# EAGLE design Organ Power Supply v0.3 (EAGLE 8.4.0)
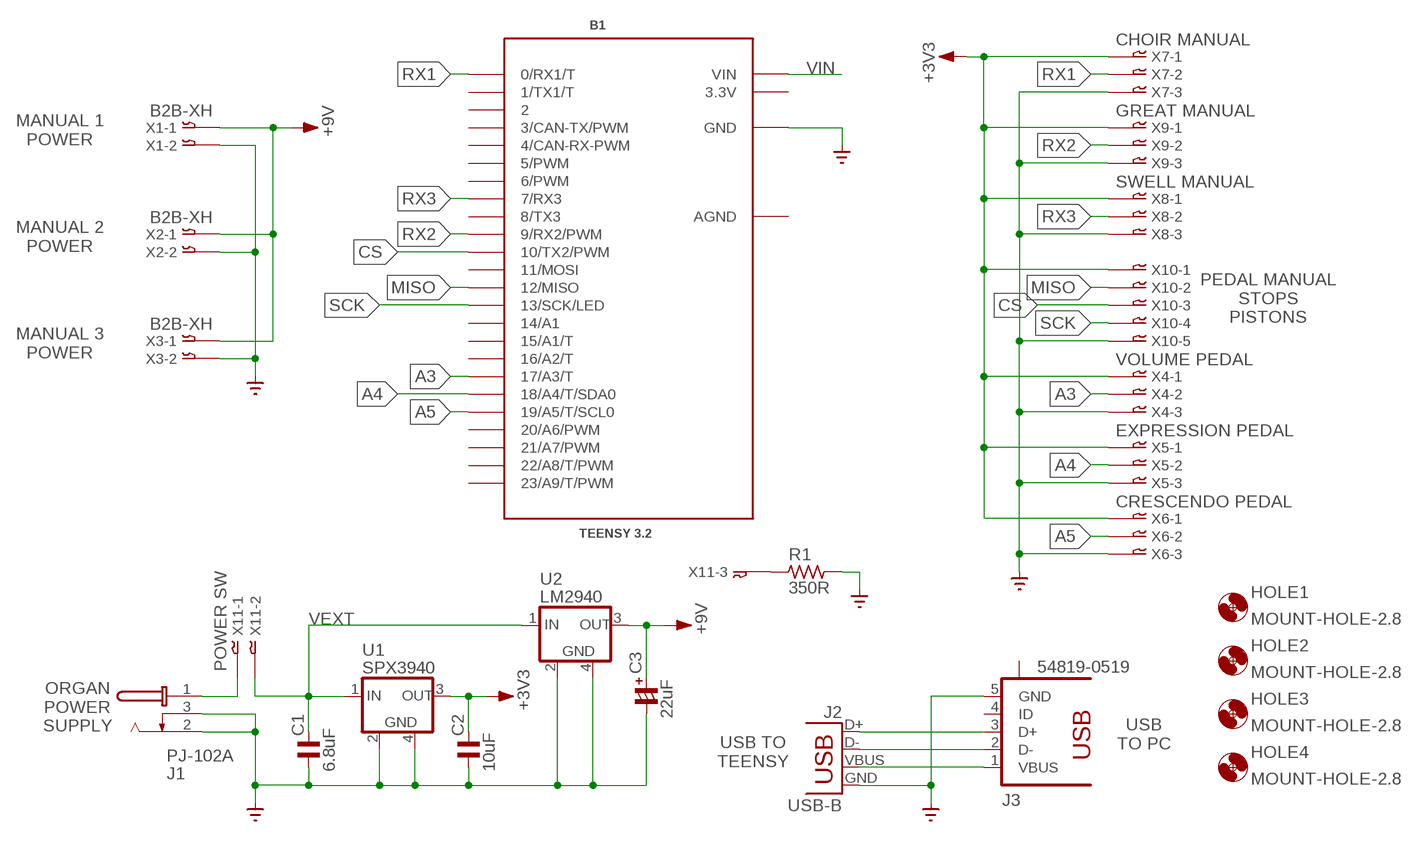
[diagram p0: schematic, sheet 1]

## Parts
B1  TEENSY 3.2  TEENSY_3.1_DIL  [TEENSY3-DIL]
C1  6.8uF  C_1206MP  [C1206MP]
C2  10uF  C_0805MP  [C0805MP]
C3  22uF  CP_3216-18R  [C3216-18R/T]
HOLE1  MOUNT-HOLE-2.8  [2,8]
HOLE2  MOUNT-HOLE-2.8  [2,8]
HOLE3  MOUNT-HOLE-2.8  [2,8]
HOLE4  MOUNT-HOLE-2.8  [2,8]
J1  PJ-102A  [PJ-102XH]
J2  USB-B  USBPTH  [USB-B-PTH]
J3  54819-0519  [54819-0519]
R1  350R  R_0805MP  [R0805MP]
U1  SPX3940  LM340NS  [SOT223]
U2  LM2940  LM340NS  [SOT223]
X1  B2B-XH  [B2B-XH-A]
X2  B2B-XH  [B2B-XH-A]
X3  B2B-XH  [B2B-XH-A]
X4  VOLUME PEDAL  03-JST-B3B-XH-A  [B3B-XH]
X5  EXPRESSION PEDAL  03-JST-B3B-XH-A  [B3B-XH]
X6  CRESCENDO PEDAL  03-JST-B3B-XH-A  [B3B-XH]
X7  CHOIR MANUAL  03-JST-B3B-XH-A  [B3B-XH]
X8  SWELL MANUAL  03-JST-B3B-XH-A  [B3B-XH]
X9  GREAT MANUAL  03-JST-B3B-XH-A  [B3B-XH]
X10  05-JST-B5B-XH-A  [B5B-XH]
X11  POWER SW  03-JST-B3B-XH-A  [B3B-XH]

## Nets
+3V3: C2.2 U1.3(OUT) X4.P$1 X5.P$1 X6.P$1 X7.P$1 X8.P$1 X9.P$1 X10.P$1
+9V: C3.+ U2.3(OUT) X1.P$1 X2.P$1 X3.P$1
A3: B1.17/A3(17/A3/T) X4.P$2
A4: B1.18/A4(18/A4/T/SDA0) X5.P$2
A5: B1.19/A5(19/A5/T/SCL0) X6.P$2
CS: B1.10(10/TX2/PWM) X10.P$3
GND: B1.GND C1.1 C2.1 C3.- J1.2(S) J1.3(SS) J2.GND J3.5(GND) R1.2 U1.2(GND) U1.4(GND) U2.2(GND) U2.4(GND) X1.P$2 X2.P$2 X3.P$2 X4.P$3 X5.P$3 X6.P$3 X7.P$3 X8.P$3 X9.P$3 X10.P$5
MISO: B1.12(12/MISO) X10.P$2
N$1: J2.VBUS J3.1(VBUS)
N$2: J1.1(T) X11.P$1
N$3: R1.1 X11.P$3
N$8: J2.D+ J3.3(D+)
N$9: J2.D- J3.2(D-)
RX1: B1.0(0/RX1/T) X7.P$2
RX2: B1.9(9/RX2/PWM) X9.P$2
RX3: B1.7(7/RX3) X8.P$2
SCK: B1.13(13/SCK/LED) X10.P$4
VEXT: C1.2 U1.1(IN) U2.1(IN) X11.P$2
VIN: B1.VIN
Unconnected: B1.1(1/TX1/T) B1.2 B1.3(3/CAN-TX/PWM) B1.4(4/CAN-RX-PWM) B1.5(5/PWM) B1.6(6/PWM) B1.8(8/TX3) B1.11(11/MOSI) B1.14/A0(14/A1) B1.15/A1(15/A1/T) B1.16/A2(16/A2/T) B1.20/A6(20/A6/PWM) B1.21/A7(21/A7/PWM) B1.22/A8(22/A8/T/PWM) B1.23/A9(23/A9/T/PWM) J3.4(ID) J3.S1 J3.S2

## Notes on the sheet
- MANUAL 1
  POWER
- MANUAL 2
  POWER
- PEDAL MANUAL
  STOPS
  PISTONS
- MANUAL 3
  POWER
- ORGAN
  POWER
  SUPPLY
- USB
  TO PC
- USB TO
  TEENSY

## Power pins joined to a net without a drawn wire
3.3V: B1.3.3V
AGND: B1.AGND

## Library data of the parts
B1 = Teensy_3_and_LC_Series_Boards_v1.1:TEENSY_3.1_DIL: Teensy 3.1 or 3.2 in a DIL Layout.
C1 C2 = rc-master-smd:C_: NON-POLARIZED CAP
C3 = rc-master:CP_: POLARIZED CAP
HOLE1-HOLE4 = holes:MOUNT-HOLE-: MOUNTING HOLE with drill center marker; BOM: EXCLUDE
J1 = jdc:PJ-102A: DC Power Jack PJ-102A (2.0 x 5.5 MM)
J2 = SparkFun-Connectors:USB: USB Connectors USB-B-PTH is fully proven SKU : PRT-00139/CONN-08278 USB-miniB is fully proven SKU : PRT-00587 USB-A-PCB is untested. USB-A-H is throughly reviewed, but untested. Spark Fun Electronics SKU : PRT-00437 USB-B-SMT is throughly reviewed, but untested. Needs silkscreen touching up. USB-A-S has not been used/tested USB-MB-H has not been used/tested USB-MICROB has been used. CONN-09505; PROD_ID: CONN-08278
J3 = con-usb:54819-0519: USB - OTG, miniUSB Type B, Molex
R1 = rc-master-smd:R_: RESISTOR
U1 U2 = v-reg:LM340: VOLTAGE REGULATOR
X1-X3 = jdc:B2B-XH: JST CONNECTOR
X4-X9 X11 = con-jst-xh:03-JST: JST CONNECTOR
X10 = con-jst-xh:05-JST: JST CONNECTOR

## Board
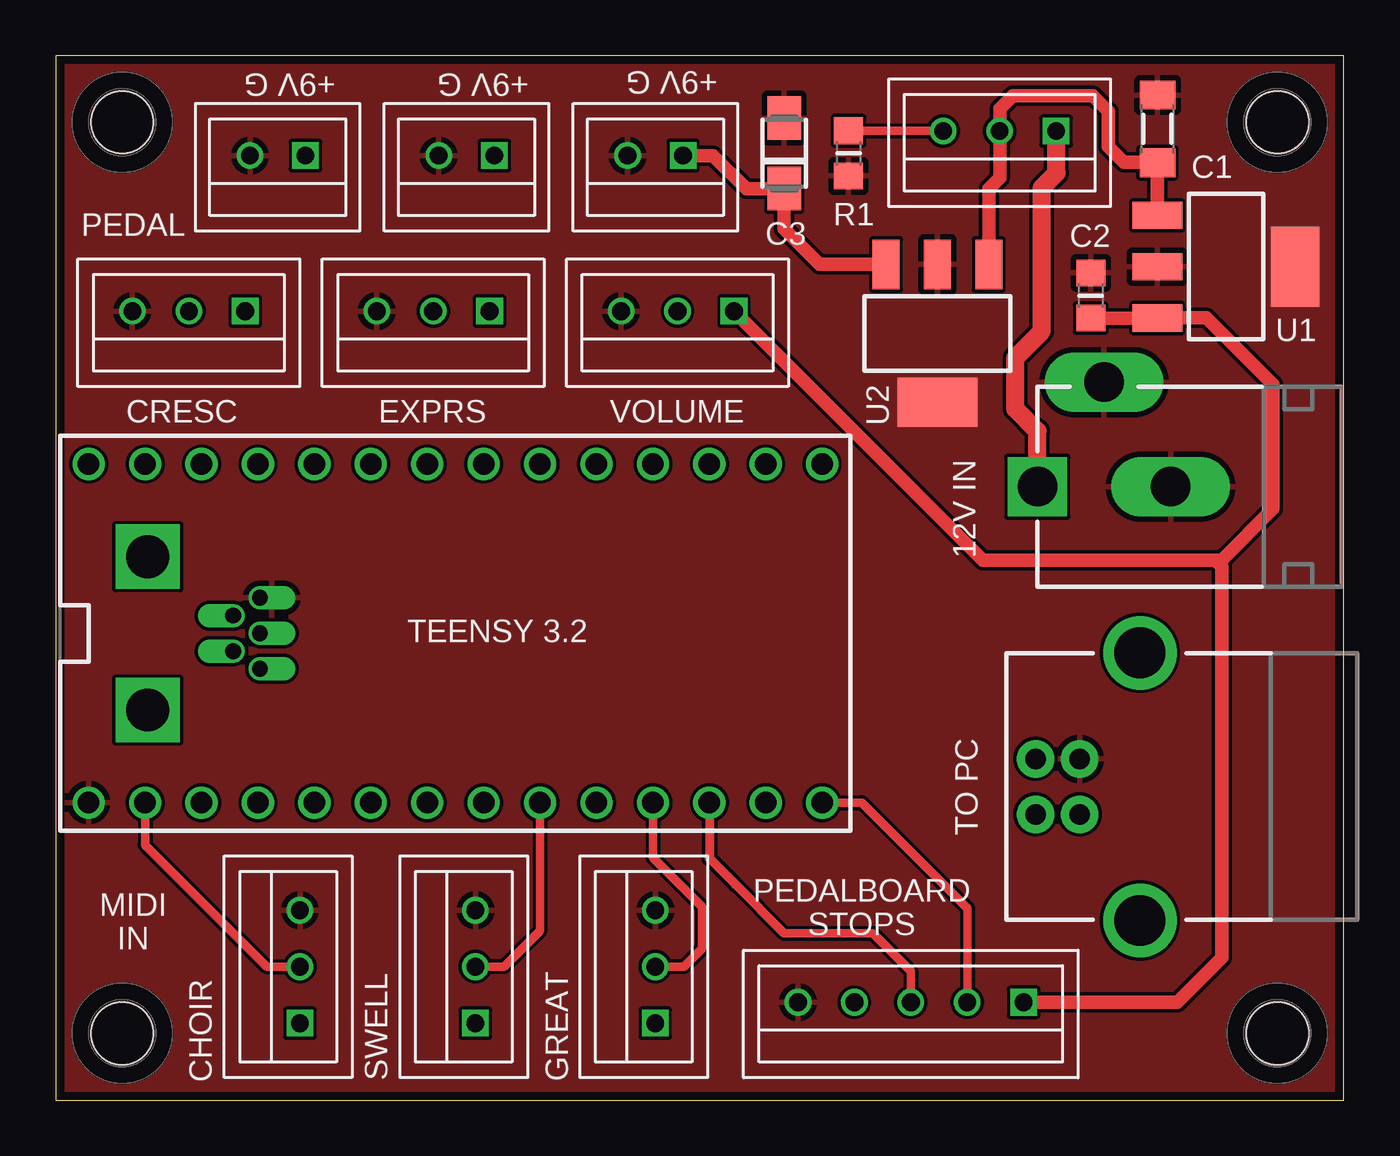
[diagram p1: board, top side]
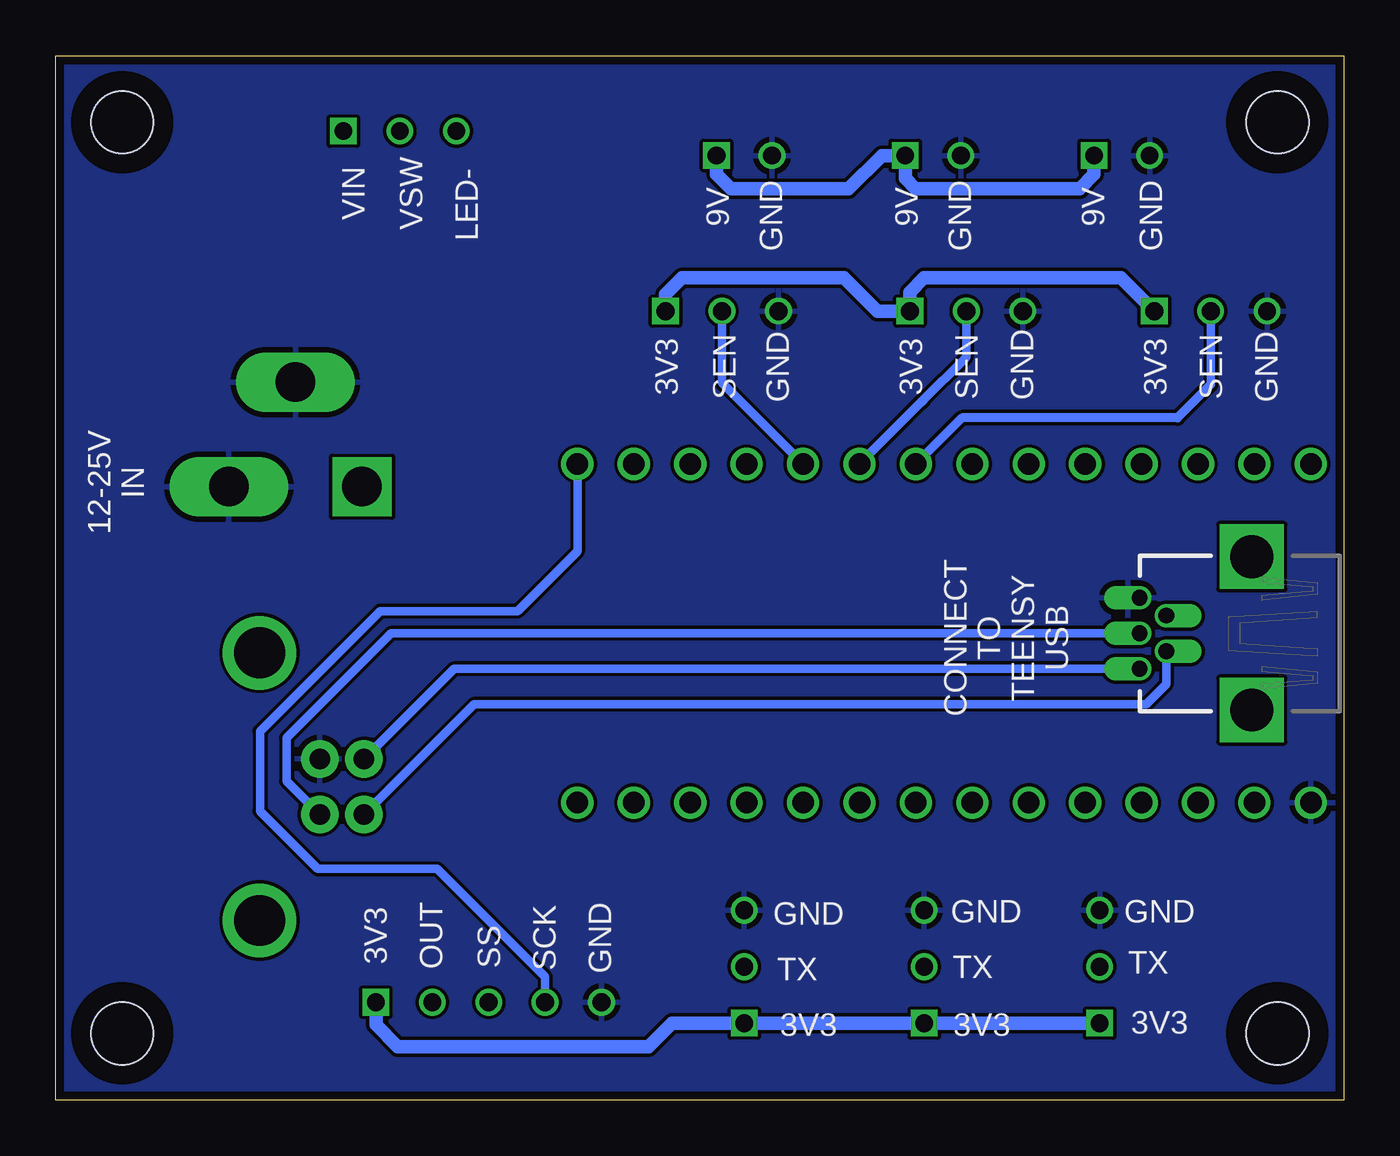
[diagram p2: board, bottom side, seen from below]

Size 58 x 47 mm. Coordinates in mm from the lower left corner, seen from the top.
Outline: 0,0 58,0 58,47 0,47 0,0
Copper layers (1*16): Top 0.0356mm / dielectric 1.5011mm / Bottom 0.0356mm
Design rules "LaenPCBOrder": minimum track width 6mil, minimum drill 13mil, track to track 6mil, track to pad 6mil, pad to pad 6mil, via to via 6mil, smd to smd 6mil, copper to edge 15mil, drill to drill 6mil, minimum pad ring 7mil, minimum via ring 7mil, stop-mask expansion 4mil, vias tented up to drill 0mil, thermal gap 10mil

### Footprints (pad centres in the part's own frame; a part is rotated, then mirrored left to right if it is on the bottom)
TEENSY3-DIL = drill 0.965: 0 -7.62,13.97; 1 -7.62,11.43; 2 -7.62,8.89; 3 -7.62,6.35; 3.3V 7.62,11.43; 4 -7.62,3.81; 5 -7.62,1.27; 6 -7.62,-1.27; 7 -7.62,-3.81; 8 -7.62,-6.35; 9 -7.62,-8.89; 10 -7.62,-11.43; 11 -7.62,-13.97; 12 -7.62,-16.51; 13 7.62,-16.51; 14/A0 7.62,-13.97; 15/A1 7.62,-11.43; 16/A2 7.62,-8.89; 17/A3 7.62,-6.35; 18/A4 7.62,-3.81; 19/A5 7.62,-1.27; 20/A6 7.62,1.27; 21/A7 7.62,3.81; 22/A8 7.62,6.35; 23/A9 7.62,8.89; AGND 7.62,13.97; GND -7.62,16.51; VIN 7.62,16.51
C1206MP = smd 1.3 x 1.6: 1 -1.524,0; 2 1.524,0
C0805MP = smd 1.2 x 1.3: 1 -1.016,0; 2 1.016,0
C3216-18R/T = smd 1.95 x 1.5: + 1.587,0; - -1.587,0
2,8 = hole 2.8: 0,0
PJ-102XH = drill 1.778 square: 1 0,0 | drill 1.778 pad 2.54 long: 2 0,-6; 3 4.7,-3
USB-B-PTH = drill 0.914 pad 1.676: D+ 0,1.25; D- 1.981,1.25; GND 0,-1.25; VBUS 1.981,-1.25 | drill 2.286: S1 -2.718,-6.02; S2 -2.718,6.02
54819-0519 = drill 0.711 offset: 1 1.6,0; 2 0.8,1.2; 3 0,0; 4 -0.8,1.2; 5 -1.6,0 | drill 1.93 square: S1 -3.45,5.05; S2 3.45,5.05
R0805MP = smd 1.2 x 1.3: 1 -1.016,0; 2 1.016,0
SOT223 = smd 1.219 x 2.235: 1 -2.311,-3.099; 2 0,-3.099; 3 2.311,-3.099 | smd 3.6 x 2.2: 4 0,3.099
B2B-XH-A = drill 0.8 square: P$1 -1.25,0 | drill 0.8: P$2 1.25,0
B3B-XH = drill 0.8 square: P$1 -2.54,0 | drill 0.8: P$2 0,0; P$3 2.54,0
B5B-XH = drill 0.8 square: P$1 -5.08,0 | drill 0.8: P$2 -2.54,0; P$3 0,0; P$4 2.54,0; P$5 5.08,0

### Placement (x,y rotation side)
B1  18,21 90 top
C1  49.6,43.7 270 top
C2  46.6,36.2 270 top
C3  32.8,42.6 270 top
HOLE1  55,3 0 top
HOLE2  3,44 0 top
HOLE3  3,3 0 top
HOLE4  55,44 0 top
J1  44.2,27.6 90 top
J2  46.1,14.1 180 top
J3  9.2,21 270 bottom
R1  35.7,42.6 270 top
U1  52.7,37.5 270 top
U2  39.7,34.5 180 top
X1  27,42.5 180 top
X2  18.5,42.5 180 top
X3  10,42.5 180 top
X4  28,35.5 180 top
X5  17,35.5 180 top
X6  6,35.5 180 top
X7  11,6 90 top
X8  18.9,6 90 top
X9  27,6 90 top
X10  38.5,4.4 180 top
X11  42.5,43.6 180 top

### Tracks (layer width: path | path; a pad name or v marks a point on that pad's centre or on a via)
+3V3
  Top 0.61: C2.2 U1.3 49.61,35.2 51.8,35.2 54.8,32.2 54.8,26.6 52.5,24.3 52.2,24.3 | X4.P$1 41.74,24.3 52.2,24.3 | X10.P$1 50.5,4.4 52.5,6.4 52.5,24 52.2,24.3
  Bottom 0.61: X7.P$1 X8.P$1 X9.P$1 30.24,3.46 31.3,2.4 42.6,2.4 43.58,3.38 X10.P$1 | X4.P$1 30.54,36.26 29.8,37 22.5,37 21,35.5 X5.P$1 19.54,36.36 18.9,37 10.04,37 X6.P$1
+9V
  Top 0.61: X1.P$1 29.6,42.5 31.1,41 32.79,41 C3.+ 32.8,39.2 34.4,37.6 U2.3
  Bottom 0.61: X3.P$1 11.25,41.65 11.9,41 19.28,41 19.75,41.47 X2.P$1 20.8,42.5 22.3,41 27.6,41 28.25,41.65 X1.P$1
A3
  Bottom 0.381: X4.P$2 28,32.27 B1.17/A3
A4
  Bottom 0.381: X5.P$2 17,33.43 19.02,31.41
  Bottom 0.406: 18.93,31.5 19.02,31.41 B1.18/A4
A5
  Bottom 0.381: X6.P$2 6,32.2
  Bottom 0.406: 6,32.2 6.45,31.75 7.5,30.7 17.19,30.7 B1.19/A5
CS
  Top 0.381: 30.6,9.7 32.8,7.5 36.8,7.5 38.5,5.8 X10.P$3
  Top 0.406: B1.10 29.43,10.87 30.6,9.7
GND
  pour Top: -1,-1 59,-1 59,48 -1,48
  pour Bottom: -2,-2 60,-2 60,49 -2,49
MISO
  Top 0.381: B1.12 36.3,13.38 41.05,8.63 X10.P$2
N$1
  Bottom 0.381: J3.1 40.07,19.4 J2.VBUS
N$2
  Top 0.813: J1.1 44.2,30.1 43.2,31.1 43.2,33.4 44.4,34.6 44.4,41.05 45.06,41.71 45.06,43.58 X11.P$1
N$3
  Top 0.381: R1.1 39.44,43.62 X11.P$3
N$8
  Bottom 0.381: J3.3 42.9,21 47.6,16.3 47.6,14.35 J2.D+
N$9
  Bottom 0.381: J3.2 8,18.7 8.9,17.8 39.17,17.8 J2.D-
RX1
  Top 0.381: B1.0 4.03,11.47 9.5,6 X7.P$2
RX2
  Top 0.381: B1.9 26.89,10.91 29.1,8.7 29.1,6.8 28.3,6 X9.P$2
RX3
  Top 0.381: B1.7 21.81,7.61 20.2,6 X8.P$2
SCK
  Bottom 0.381: B1.13 34.51,24.69 37.2,22 43.4,22 48.8,16.6 48.8,13 46.2,10.4 40.82,10.4 35.96,5.54 X10.P$4
VEXT
  Top 0.61: U1.1 C1.2 49.58,42.2 48.1,42.2 47.4,42.9 47.4,44.5 46.7,45.2 43.1,45.2 42.5,44.6 X11.P$2 42.5,41.5 42.01,41.01 U2.1

### Text on the board
tNames: +9V G | +9V G | +9V G | PEDAL | CRESC | EXPRS | VOLUME | 12V IN | TEENSY 3.2 | TO PC | MIDI / IN | PEDALBOARD / STOPS | CHOIR | SWELL | GREAT
bNames: VSW | VIN | GND | 9V | GND | 9V | GND | 9V | LED- | GND | SEN | 3V3 | GND | SEN | 3V3 | GND | SEN | 3V3 | 12-25V / IN | CONNECT / TO / TEENSY / USB | GND | GND | GND | TX | GND | SCK | SS | OUT | 3V3 | TX | TX | 3V3 | 3V3 | 3V3